# EasyEDA Pro project ProPrj_cheap-board_2026-05-07.epro, schematic Schematic1
Board Name: Board1; Create Date: 2026-01-30; Page Name: P1; Project Name: cheap-board; Schematic Name: Schematic1; Update Date: 2026-02-26; Company: EasyEDA.com; Page Size: A4; Version: V1.0
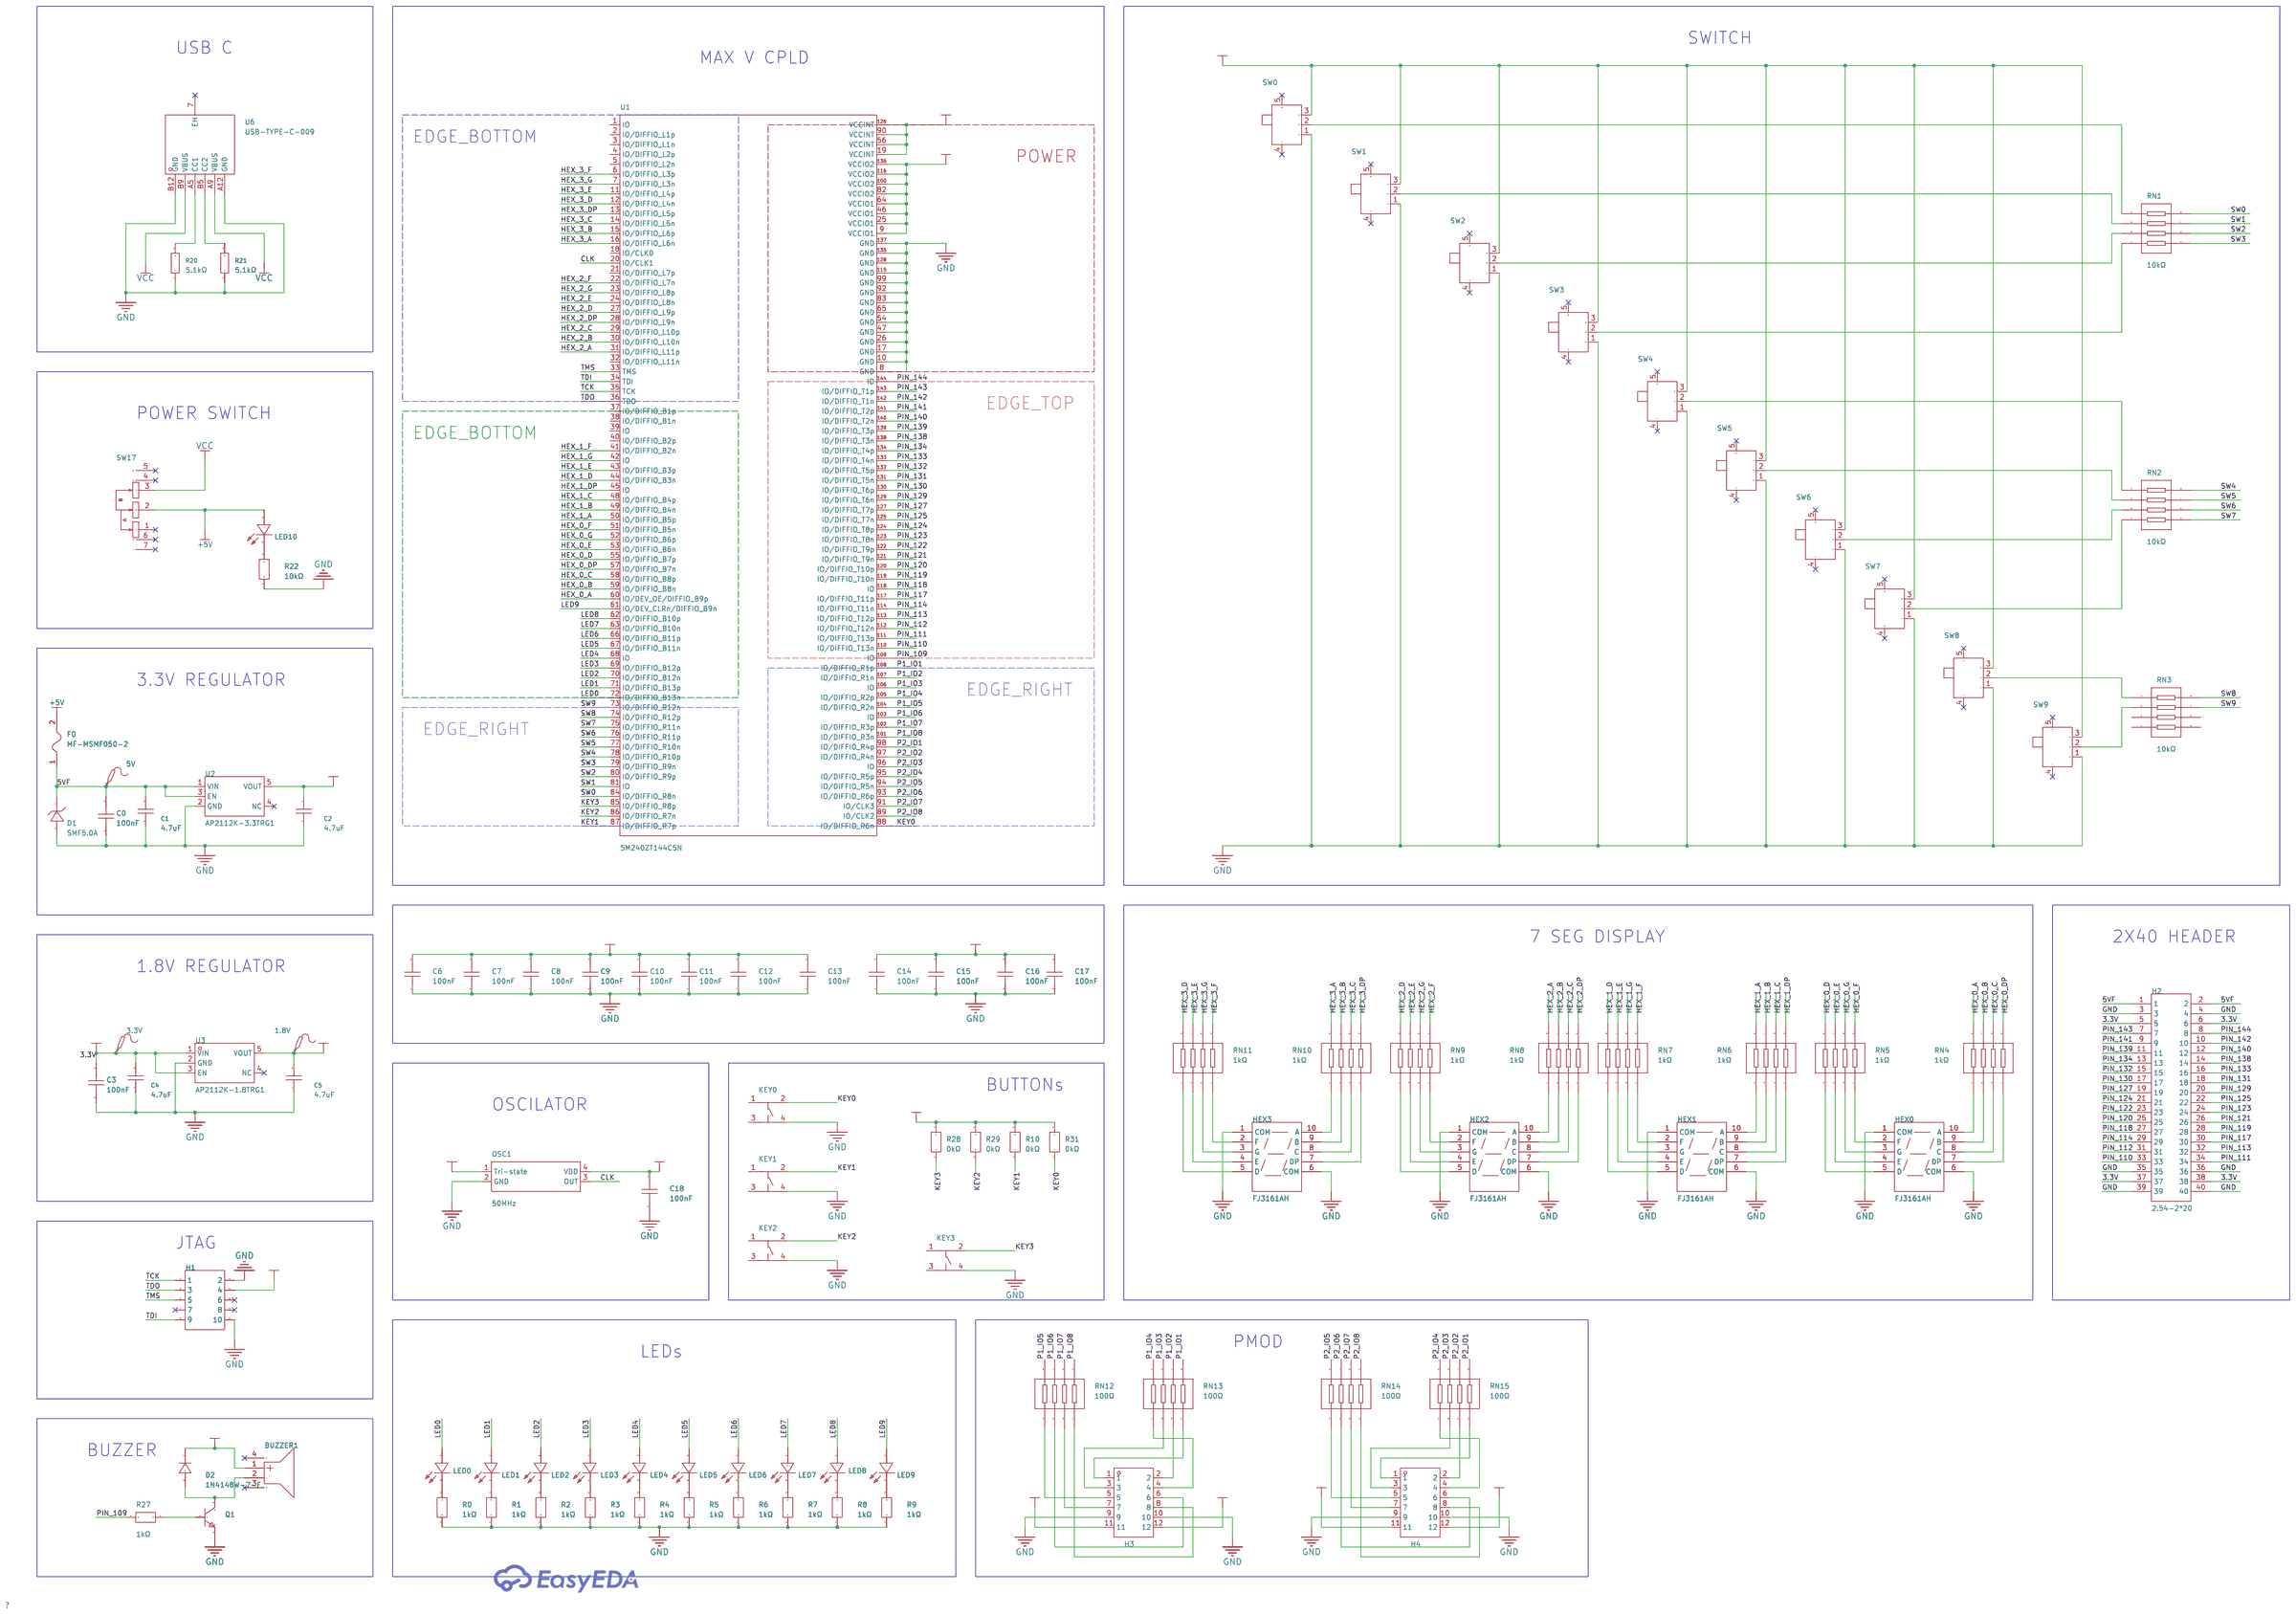
[diagram p0: schematic sheet]

## Parts
1.8V  -  [Test-Point-0.5mm]
3.3V  -  [Test-Point-0.5mm]
5V  -  [Test-Point-0.5mm]
BUZZER1  2.7kHz  [BUZ-SMD_4P-L7.5-W7.5-P7.59-TL]
C0  100nF  [C0603]
C1  4.7uF  [C0603]
C2  4.7uF  [C0603]
C3  100nF  [C0603]
C4  4.7uF  [C0603]
C5  4.7uF  [C0603]
C6  100nF  [C0603]
C7  100nF  [C0603]
C8  100nF  [C0603]
C9  100nF  [C0603]
C10  100nF  [C0603]
C11  100nF  [C0603]
C12  100nF  [C0603]
C13  100nF  [C0603]
C14  100nF  [C0603]
C15  100nF  [C0603]
C16  100nF  [C0603]
C17  100nF  [C0603]
C18  100nF  [C0603]
D1  SMF5.0A  [SOD-123FL_L2.7-W1.8-LS3.8-RD]
D2  1N4148W-7-F  [SOD-123_L2.7-W1.6-LS3.7-RD-1]
F0  MF-MSMF050-2  [F1812]
H1  2.54-2*5P简牛  [IDC-TH_10P-P2.54_C5665]
H2  2.54-2*20  [HDR-TH_40P-P2.54-V-F-R2-C20-S2.54]
H3  HX PM2.54-2x6P WC  [HDR-TH_12P-P2.54-H-F-R2-C6-S2.54-W12.7-N]
H4  HX PM2.54-2x6P WC  [HDR-TH_12P-P2.54-H-F-R2-C6-S2.54-W12.7-N]
HEX0  FJ3161AH  [LED-SEG-TH_10P-L14.0-W7.5-P2.54-S5.08-TL]
HEX1  FJ3161AH  [LED-SEG-TH_10P-L14.0-W7.5-P2.54-S5.08-TL]
HEX2  FJ3161AH  [LED-SEG-TH_10P-L14.0-W7.5-P2.54-S5.08-TL]
HEX3  FJ3161AH  [LED-SEG-TH_10P-L14.0-W7.5-P2.54-S5.08-TL]
KEY0  KH-6X6X6H-STM  [SW-SMD_4P-L6.0-W6.0-P4.50-LS9.0_KH-6X6X6H-STM]
KEY1  KH-6X6X6H-STM  [SW-SMD_4P-L6.0-W6.0-P4.50-LS9.0_KH-6X6X6H-STM]
KEY2  KH-6X6X6H-STM  [SW-SMD_4P-L6.0-W6.0-P4.50-LS9.0_KH-6X6X6H-STM]
KEY3  KH-6X6X6H-STM  [SW-SMD_4P-L6.0-W6.0-P4.50-LS9.0_KH-6X6X6H-STM]
LED0  YLED0603R  [LED0603-FD]
LED1  YLED0603R  [LED0603-FD]
LED2  YLED0603R  [LED0603-FD]
LED3  YLED0603R  [LED0603-FD]
LED4  YLED0603R  [LED0603-FD]
LED5  YLED0603R  [LED0603-FD]
LED6  YLED0603R  [LED0603-FD]
LED7  YLED0603R  [LED0603-FD]
LED8  YLED0603R  [LED0603-FD]
LED9  YLED0603R  [LED0603-FD]
LED10  YLED0603R  [LED0603-FD]
OSC1  50MHz  [OSC-SMD_4P-L3.2-W2.5-BL]
Q1  MMBT3904LT1G  [SOT-23-3_L2.9-W1.6-P1.90-LS2.8-BR]
R0  1kΩ  [R0603]
R1  1kΩ  [R0603]
R2  1kΩ  [R0603]
R3  1kΩ  [R0603]
R4  1kΩ  [R0603]
R5  1kΩ  [R0603]
R6  1kΩ  [R0603]
R7  1kΩ  [R0603]
R8  1kΩ  [R0603]
R9  1kΩ  [R0603]
R10  0kΩ  [R0603]
R20  5.1kΩ  [R0603]
R21  5.1kΩ  [R0603]
R22  10kΩ  [R0603]
R27  1kΩ  [R0603]
R28  0kΩ  [R0603]
R29  0kΩ  [R0603]
R31  0kΩ  [R0603]
RN1  10kΩ  [RES-ARRAY-SMD_0603-8P-L3.2-W1.6-BL]
RN2  10kΩ  [RES-ARRAY-SMD_0603-8P-L3.2-W1.6-BL]
RN3  10kΩ  [RES-ARRAY-SMD_0603-8P-L3.2-W1.6-BL]
RN4  1kΩ  [RES-ARRAY-SMD_0603-8P-L3.2-W1.6-BL]
RN5  1kΩ  [RES-ARRAY-SMD_0603-8P-L3.2-W1.6-BL]
RN6  1kΩ  [RES-ARRAY-SMD_0603-8P-L3.2-W1.6-BL]
RN7  1kΩ  [RES-ARRAY-SMD_0603-8P-L3.2-W1.6-BL]
RN8  1kΩ  [RES-ARRAY-SMD_0603-8P-L3.2-W1.6-BL]
RN9  1kΩ  [RES-ARRAY-SMD_0603-8P-L3.2-W1.6-BL]
RN10  1kΩ  [RES-ARRAY-SMD_0603-8P-L3.2-W1.6-BL]
RN11  1kΩ  [RES-ARRAY-SMD_0603-8P-L3.2-W1.6-BL]
RN12  100Ω  [RES-ARRAY-SMD_0603-8P-L3.2-W1.6-BL]
RN13  100Ω  [RES-ARRAY-SMD_0603-8P-L3.2-W1.6-BL]
RN14  100Ω  [RES-ARRAY-SMD_0603-8P-L3.2-W1.6-BL]
RN15  100Ω  [RES-ARRAY-SMD_0603-8P-L3.2-W1.6-BL]
SW0  SS12F44G4  [SW-TH_SHOU-HAN_SS12F44G4]
SW1  SS12F44G4  [SW-TH_SHOU-HAN_SS12F44G4]
SW2  SS12F44G4  [SW-TH_SHOU-HAN_SS12F44G4]
SW3  SS12F44G4  [SW-TH_SHOU-HAN_SS12F44G4]
SW4  SS12F44G4  [SW-TH_SHOU-HAN_SS12F44G4]
SW5  SS12F44G4  [SW-TH_SHOU-HAN_SS12F44G4]
SW6  SS12F44G4  [SW-TH_SHOU-HAN_SS12F44G4]
SW7  SS12F44G4  [SW-TH_SHOU-HAN_SS12F44G4]
SW8  SS12F44G4  [SW-TH_SHOU-HAN_SS12F44G4]
SW9  SS12F44G4  [SW-TH_SHOU-HAN_SS12F44G4]
SW17  MK-12C02-G020  [SW-SMD_MK-12C02-G020]
U1  5M240ZT144C5N  [TQFP-144_L20.0-W20.0-P0.50-LS22.0-BL]
U2  AP2112K-3.3TRG1  [SOT-23-5_L2.9-W1.6-P0.95-LS2.8-BR]
U3  AP2112K-1.8TRG1  [SOT-25_L3.0-W1.6-P0.95-LS2.8-BL]
U6  USB-TYPE-C-009  [TYPE-C-SMD_TYPE-C-6P]

## Library data of the parts
1.8V 3.3V 5V = Test-Point: Test Point 测试点
BUZZER1 = MLT-7525: Driver Circuitry:Passive (Externally Driven) Technology:Electromagnetic Voltage Rating:3.6V Voltage - Supply:2.5V~4.5V Voltage - Supply:2.5V~4.5V Frequency:2.7kHz Current Consumption:95mA Sound Pressure Level(SPL):80dB Length:7.5mm Width:7.5mm Height:2.8m; LCSC Part Name: 无源(外部驱动) 电磁式 2.7kHz; Supplier Part: C95299; Manufacturer: 华能; Supplier Footprint: SMD,7.5x7.5mm; JLCPCB Part Class: Extended Part; Datasheet: https://item.szlcsc.com/datasheet/MLT-7525/96501.html; Supplier: LCSC; Driver Circuitry: Passive (Externally Driven); Technology: Electromagnetic; Voltage Rating: 3.6V; Voltage - Supply: 2.5V~4.5V; Current Consumption: 95mA; Sound Pressure Level(SPL): 80dB; Length: 7.5mm; Width: 7.5mm; Height: 2.8mm; Operating Temperature: -20℃~+70℃
C0 C3 C6-C18 = CC0603KRX7R9BB104: Capacitance:100nF Tolerance:±10% Tolerance:±10% Voltage Rating:50V Temperature Coefficient:X7R; LCSC Part Name: 100nF ±10% 50V; Supplier Part: C14663; Manufacturer: YAGEO(国巨); Supplier Footprint: 0603; JLCPCB Part Class: Basic Part; Datasheet: https://atta.szlcsc.com/upload/public/pdf/source/20180910/C282072_33301C7F631E79921B82A8DAC6BCC5B3.pdf; Supplier: LCSC; Tolerance: ±10%; Voltage Rating: 50V; Temperature Coefficient: X7R
C1 C2 C4 C5 = CGA0603X7R475K160JT: Capacitance:4.7uF Tolerance:±10% Tolerance:±10% Voltage Rating:16V Temperature Coefficient:X7R; LCSC Part Name: 4.7uF ±10% 16V; Supplier Part: C22399629; Manufacturer: HRE(芯声); Supplier Footprint: 0603; JLCPCB Part Class: Extended Part; Datasheet: https://item.szlcsc.com/datasheet/CGA0603X7R475K160JT/24016453.html; Supplier: LCSC; Tolerance: ±10%; Voltage Rating: 16V; Temperature Coefficient: X7R
D1 = SMF5.0A_C193402: Polarity:Unidirectional Reverse Stand-Off Voltage (Vrwm):5V Clamping Voltage:9.2V Peak Pulse Current (Ipp):21.7A@10/1000us Peak Pulse Power Dissipation (Ppp):200W@10/1000us Voltage - Breakdown:7V Reverse Leakage Current (Ir):400uA Number of Channels:- Ope; LCSC Part Name: 单向TVS 5V截止 峰值脉冲电流：21.7A@10/1000us; Supplier Part: C193402; Manufacturer: MDD(辰达半导体); Supplier Footprint: SOD-123FL; JLCPCB Part Class: Extended Part; Datasheet: https://item.szlcsc.com/datasheet/SMF5.0A/231120.html; Supplier: LCSC; Polarity: Unidirectional; Reverse Stand-Off Voltage (Vrwm): 5V; Clamping Voltage: 9.2V; Peak Pulse Current (Ipp): 21.7A@10/1000us; Peak Pulse Power Dissipation (Ppp): 200W@10/1000us; Voltage - Breakdown: 7V; Reverse Leakage Current (Ir): 400uA; Operating Temperature: -55℃~+150℃; Type: TVS
D2 = 1N4148W-7-F: Diode Configuration:Independent Voltage - Forward(Vf@If):1.25V@150mA Voltage - DC Reverse(Vr):100V Current - Rectified:300mA Pd - Power Dissipation:400mW Reverse Leakage Current (Ir):1uA@75V Reverse Recovery Time (trr):4ns Operating Junction Temperature R; LCSC Part Name: 100V 300mA; Supplier Part: C83528; Manufacturer: DIODES(美台); Supplier Footprint: SOD-123; JLCPCB Part Class: Extended Part; Datasheet: https://item.szlcsc.com/datasheet/1N4148W-7-F/84693.html; Supplier: LCSC; Diode Configuration: Independent; Voltage - Forward(Vf@If): 1.25V@150mA; Voltage - DC Reverse(Vr): 100V; Current - Rectified: 300mA; Pd - Power Dissipation: 400mW; Reverse Leakage Current (Ir): 1uA@75V; Reverse Recovery Time (trr): 4ns; Operating Junction Temperature Range: -65℃~+150℃@(Tj); Non-Repetitive Peak Forward Surge Current: 2A
F0 = MF-MSMF050-2: Voltage - Max:15V Current - Max:100A Hold Current:500mA Trip Current:1A Resistance - Initial (Ri) (Min):150mΩ Resistance - Post Trip (R1) (Max):1Ω Time to Trip(Max):- Operating Temperature:-40℃~+85℃ Operating Temperature:-40℃~+85℃ Length:5.4mm Width:3.2mm; LCSC Part Name: 15V 500mA 1812自恢复; Supplier Part: C17313; Manufacturer: BOURNS; Supplier Footprint: 1812; JLCPCB Part Class: Extended Part; Datasheet: https://item.szlcsc.com/datasheet/MF-MSMF050-2/17998.html; Supplier: LCSC; Voltage - Max: 15V; Current - Max: 100A; Hold Current: 500mA; Trip Current: 1A; Resistance - Initial (Ri) (Min): 150mΩ; Resistance - Post Trip (R1) (Max): 1Ω; Operating Temperature: -40℃~+85℃; Length: 5.4mm; Width: 3.2mm
H1 = 2.54-2*5P简牛: Connector Type:IDC Header Pitch:2.54mm Number of Positions or Pins:2x5P Current Rating:1A Holder Type:Through Hole Row Spacing:2.54mm Number of Rows:2 Number of PINs Per Row:5 Contact Material:Brass Contact Plating:Gold Operating Temperature:-55℃~+105℃ Op; LCSC Part Name: 2.54mm 2x5P 排数:2 每排P数:5; Supplier Part: C5665; Manufacturer: BOOMELE(博穆精密); Supplier Footprint: 插件,P=2.54mm; JLCPCB Part Class: Extended Part; Datasheet: https://item.szlcsc.com/datasheet/2.54-2*5P%25E7%25AE%2580%25E7%2589%259B/6118.html; Supplier: LCSC; Connector Type: IDC Header; Pitch: 2.54mm; Number of Positions or Pins: 2x5P; Current Rating: 1A; Holder Type: Through Hole; Row Spacing: 2.54mm; Number of Rows: 2; Number of PINs Per Row: 5; Contact Material: Brass; Contact Plating: Gold; Operating Temperature: -55℃~+105℃; Color: Black
H2 = 2.54-2*20: Holes Structure:2x20P Pitch:2.54mm Row Spacing:2.54mm Circular Hole / Square Hole:Square Hole Mounting Type:Through Hole Number of Rows:2 Number of Positions:40P Current Rating:2.5A Voltage Rating (Max):- Holes Direction:Top Insulation Height:8.5mm Operat; LCSC Part Name: 间距:2.54mm 2x20P 直插; Supplier Part: C2977589; Manufacturer: ZHOURI(洲日); Supplier Footprint: 插件,P=2.54mm; JLCPCB Part Class: Extended Part; Datasheet: https://item.szlcsc.com/datasheet/2.54-2*20/3388941.html; Supplier: LCSC; Holes Structure: 2x20P; Pitch: 2.54mm; Row Spacing: 2.54mm; Circular Hole / Square Hole: Square Hole; Mounting Type: Through Hole; Number of Rows: 2; Number of Positions: 40P; Current Rating: 2.5A; Holes Direction: Top; Insulation Height: 8.5mm; Operating Temperature: -40℃~+105℃
H3 H4 = HX PM2.54-2x6P WC: Holes Structure:2x6P Pitch:2.54mm Row Spacing:2.54mm Circular Hole / Square Hole:Square Hole Mounting Type:Right Angle Number of Rows:2 Number of Positions:12P Current Rating:3A Voltage Rating (Max):1kV Holes Direction:Side Insulation Height:8.5mm Contact; LCSC Part Name: 2x6P 间距:2.54mm 弯插; Supplier Part: C41417336; Manufacturer: hanxia(韩下); Supplier Footprint: 弯插,P=2.54mm; Datasheet: https://item.szlcsc.com/datasheet/HX%2520PM2.54-2x6P%2520WC/43243340.html; Supplier: LCSC; Holes Structure: 2x6P; Pitch: 2.54mm; Row Spacing: 2.54mm; Circular Hole / Square Hole: Square Hole; Mounting Type: Right Angle; Number of Rows: 2; Number of Positions: 12P; Current Rating: 3A; Voltage Rating (Max): 1kV; Holes Direction: Side; Insulation Height: 8.5mm; Contact Material: Brass; Contact Plating: Gold; Operating Temperature: -40℃~+105℃; PIN Length: 3.2mm
HEX0-HEX3 = FJ3161AH: Digit/Alpha Size(inch):0.36 Illumination Color:Red LED Polarity:Common Cathode; LCSC Part Name: 0.36英寸红色数码管 共阴极; Supplier Part: C10684; Manufacturer: 志浩; Supplier Footprint: 插件; JLCPCB Part Class: Extended Part; Datasheet: https://item.szlcsc.com/datasheet/FJ3161AH/11228.html; Supplier: LCSC; Digit/Alpha Size(inch): 0.36; Illumination Color: Red; LED Polarity: Common Cathode
KEY0-KEY3 = KH-6X6X6H-STM: Circuit:SPST Actuator Style:Round Button Mounting Type:Surface Mount,Vertical Length:6mm Width:6mm Switch Height:6mm with Bracket:Without Bracket Contact Current:50mA Voltage Rating:12V Actuator/Cap Color:Black Termination Style:Gull Wing Life:80,000 Cycl; LCSC Part Name: 6*6*6mm 立贴 轻触开关; Supplier Part: C2837532; Manufacturer: kinghelm(金航标); Supplier Footprint: SMD-4P,6x6mm; JLCPCB Part Class: Extended Part; Datasheet: https://item.szlcsc.com/datasheet/KH-6X6X6H-STM/3009602.html; Supplier: LCSC; Circuit: SPST; Actuator Style: Round Button; Mounting Type: Surface Mount,Vertical; Length: 6mm; Width: 6mm; Switch Height: 6mm; with Bracket: Without Bracket; Contact Current: 50mA; Voltage Rating: 12V; Actuator/Cap Color: Black; Termination Style: Gull Wing; Life: 80,000 Cycles
LED0-LED10 = YLED0603R: Lamp Holder Type:-；- Illumination Color:Red Voltage - Forward(Vf):1.8V~2.4V Voltage - Forward(Vf):1.8V~2.4V Power(Watts):- Forward Current:25mA Wavelength - Dominant:620nm~625nm Wavelength - Dominant:620nm~625nm Peak Wavelength:- Diode Configuration:Discr; LCSC Part Name: 红色 独立二极管; Supplier Part: C19171390; Manufacturer: YONGYUTAI(永裕泰); Supplier Footprint: 0603; JLCPCB Part Class: Extended Part; Datasheet: https://item.szlcsc.com/datasheet/YLED0603R/20382441.html; Supplier: LCSC; Lamp Holder Type: -；-; Illumination Color: Red; Voltage - Forward(Vf): 1.8V~2.4V; Forward Current: 25mA; Wavelength - Dominant: 620nm~625nm; Diode Configuration: Discrete Diode; Luminous Intensity: 120mcd; Viewing Angle: 120°; Operating Temperature: -40℃~+85℃
OSC1 = OT2EL4C4JI-111OLP-50M: Frequency:50MHz Normal temperature Frequency Tolerance:±10ppm Normal temperature Frequency Tolerance:±10ppm Output Type:CMOS Voltage - Supply:1.8V~3.3V Voltage - Supply:1.8V~3.3V Frequency Stability:±20ppm Frequency Stability:±20ppm Operating Temperature:; LCSC Part Name: YSO110TR 50MHZ 1.8V-3.3V ±10PPM -40~85℃ (±20PPM) CMOS; Supplier Part: C5203552; Manufacturer: YXC(扬兴晶振); Supplier Footprint: SMD3225-4P; JLCPCB Part Class: Extended Part; Datasheet: https://item.szlcsc.com/datasheet/OT2EL4C4JI-111OLP-50M/5892914.html; Supplier: LCSC; Normal temperature Frequency Tolerance: ±10ppm; Output Type: CMOS; Voltage - Supply: 1.8V~3.3V; Frequency Stability: ±20ppm; Operating Temperature: -40℃~+85℃
Q1 = MMBT3904LT1G: type:NPN Current - Collector(Ic):200mA Collector - Emitter Voltage VCEO:40V Pd - Power Dissipation:225mW DC Current Gain:40@0.1mA,1.0V DC Current Gain:40@0.1mA,1.0V Transition frequency(fT):300MHz Current - Collector Cutoff:50nA Vce Saturation(VCE(sat)):2; LCSC Part Name: NPN 电流:200mA 电压:40V; Supplier Part: C81464; Manufacturer: onsemi(安森美); Supplier Footprint: SOT-23; JLCPCB Part Class: Extended Part; Datasheet: https://item.szlcsc.com/datasheet/MMBT3904LT1G/82615.html; Supplier: LCSC; type: NPN; Current - Collector(Ic): 200mA; Collector - Emitter Voltage VCEO: 40V; Pd - Power Dissipation: 225mW; DC Current Gain: 40@0.1mA,1.0V; Transition frequency(fT): 300MHz; Current - Collector Cutoff: 50nA; Vce Saturation(VCE(sat)): 200mV; Operating Temperature: -55℃~+150℃
R0-R10 R22 R27-R29 R31 = RC0603FR-071KL: Type:Thick Film Resistor Resistance:1kΩ Tolerance:±1% Tolerance:±1% Power(Watts):100mW Voltage-Supply(Max):75V Temperature Coefficient:±100ppm/℃ Temperature Coefficient:±100ppm/℃ Operating Temperature:-55℃~+155℃ Operating Temperature:-55℃~+155℃; LCSC Part Name: 厚膜电阻 1kΩ ±1% 100mW; Supplier Part: C22548; Manufacturer: YAGEO(国巨); Supplier Footprint: 0603; JLCPCB Part Class: Extended Part; Datasheet: https://item.szlcsc.com/datasheet/RC0603FR-071KL/23274.html; Supplier: LCSC; Type: Thick Film Resistor; Tolerance: ±1%; Power(Watts): 100mW; Voltage-Supply(Max): 75V; Temperature Coefficient: ±100ppm/℃; Operating Temperature: -55℃~+155℃
R20 R21 = RMC06035.1K1%N: Type:Thick Film Resistor Resistance:5.1kΩ Tolerance:±1% Tolerance:±1% Power(Watts):100mW Voltage-Supply(Max):50V Temperature Coefficient:±100ppm/℃ Temperature Coefficient:±100ppm/℃ Operating Temperature:-55℃~+155℃ Operating Temperature:-55℃~+155℃; LCSC Part Name: 厚膜电阻 5.1kΩ ±1% 100mW; Supplier Part: C269716; Manufacturer: Tyohm(幸亚电阻); Supplier Footprint: 0603; JLCPCB Part Class: Extended Part; Datasheet: https://item.szlcsc.com/datasheet/RMC06035.1K1%2525N/259156.html; Supplier: LCSC; Type: Thick Film Resistor; Tolerance: ±1%; Power(Watts): 100mW; Voltage-Supply(Max): 50V; Temperature Coefficient: ±100ppm/℃; Operating Temperature: -55℃~+155℃
RN1-RN3 = 4D03WGJ0103T5E: Number of Resistors: Resistance:10kΩ Tolerance:±5% Tolerance:±5% Power(Watts): Temperature Coefficient:±200ppm/℃ Temperature Coefficient:±200ppm/℃ Number of Pins:; LCSC Part Name: 10kΩ ±5%; Supplier Part: C29718; Manufacturer: UNI-ROYAL(厚声); Supplier Footprint: 0603x4; JLCPCB Part Class: Basic Part; Datasheet: https://atta.szlcsc.com/upload/public/pdf/source/20191224/C474318_2527498AE30E813171187CCD28401A71.pdf; Supplier: LCSC; Tolerance: ±5%; Temperature Coefficient: ±200ppm/℃
RN4-RN11 = 4D03WGJ0102T5E: Number of Resistors: Resistance:1kΩ Tolerance:±5% Tolerance:±5% Power(Watts): Temperature Coefficient:±200ppm/℃ Temperature Coefficient:±200ppm/℃ Number of Pins:; LCSC Part Name: 1kΩ ±5%; Supplier Part: C20197; Manufacturer: UNI-ROYAL(厚声); Supplier Footprint: 0603x4; JLCPCB Part Class: Basic Part; Datasheet: https://atta.szlcsc.com/upload/public/pdf/source/20191224/C474318_2527498AE30E813171187CCD28401A71.pdf; Supplier: LCSC; Tolerance: ±5%; Temperature Coefficient: ±200ppm/℃
RN12-RN15 = YC164-FR-07100RL: Number of Resistors: Resistance:100Ω Tolerance:±1% Tolerance:±1% Power(Watts):62.5mW Temperature Coefficient:±200ppm/℃ Temperature Coefficient:±200ppm/℃ Number of Pins:; LCSC Part Name: 100Ω ±1%; Supplier Part: C136838; Manufacturer: YAGEO(国巨); Supplier Footprint: 0603x4; JLCPCB Part Class: Extended Part; Datasheet: https://item.szlcsc.com/datasheet/YC164-FR-07100RL/148154.html; Supplier: LCSC; Tolerance: ±1%; Power(Watts): 62.5mW; Temperature Coefficient: ±200ppm/℃
SW0-SW9 = SS12F44G4: Circuit:SPDT Actuator Style:- Termination Style:PC Pin Length:12mm Width:4.5mm Switch Height:6mm Mounting Type:Through Hole Actuator Color:- Current Rating:300mA Voltage Rating:50V Life:5,000 cycles Operating Temperature:-10℃~+50℃ Operating Temperature:-1; Supplier Part: C2887261; Manufacturer: SHOU HAN(首韩); Supplier Footprint: 插件,12x4.5mm; JLCPCB Part Class: Extended Part; Datasheet: https://item.szlcsc.com/datasheet/SS12F44G4/3103829.html; Supplier: LCSC; Circuit: SPDT; Termination Style: PC Pin; Length: 12mm; Width: 4.5mm; Switch Height: 6mm; Mounting Type: Through Hole; Current Rating: 300mA; Voltage Rating: 50V; Life: 5,000 cycles; Operating Temperature: -10℃~+50℃
SW17 = MK-12C02-G020: Circuit:SPDT Actuator Style:Rectangular Columnar Termination Style:- Length:6.6mm Width:1.4mm Switch Height:4.7mm Mounting Type:Surface Mount, Right Angle Actuator Color:Black Current Rating:1A Voltage Rating:6V Life:10,000 Cycles Operating Temperature:-2; LCSC Part Name: 微型拨动开关; Supplier Part: C963206; Manufacturer: G-Switch(品赞); Supplier Footprint: SMD,6.6x1.4mm; JLCPCB Part Class: Extended Part; Datasheet: https://item.szlcsc.com/datasheet/MK-12C02-G020/1046841.html; Supplier: LCSC; Circuit: SPDT; Actuator Style: Rectangular Columnar; Length: 6.6mm; Width: 1.4mm; Switch Height: 4.7mm; Mounting Type: Surface Mount, Right Angle; Actuator Color: Black; Current Rating: 1A; Voltage Rating: 6V; Life: 10,000 Cycles; Operating Temperature: -20℃~+70℃
U1 = 5M240ZT144C5N: Type:Other PLDs Logic Array Blocks:240 Operating Temperature:0℃~+85℃ Operating Temperature:0℃~+85℃; Supplier Part: C1521424; Manufacturer: Intel/Altera; Supplier Footprint: TQFP-144(20x20); JLCPCB Part Class: Extended Part; Datasheet: https://item.szlcsc.com/datasheet/5M240ZT144C5N/1612222.html; Supplier: LCSC; Type: Other PLDs; Logic Array Blocks: 240; Operating Temperature: 0℃~+85℃
U2 = AP2112K-3.3TRG1_C23380830: Output Type:Fixed Voltage - Supply:5.5V Output Voltage:3.3V Output Voltage:3.3V Output Current:600mA Power Supply Rejection Ratio (PSRR):75dB@(1kHz) Voltage Dropout:320mV@(600mA) standby current:10uA Features:Over Temperature Protection Operating Temperat; LCSC Part Name: 3.3V 600mA 5.5V; Supplier Part: C23380830; Manufacturer: TECH PUBLIC(台舟); Supplier Footprint: SOT-23-5; JLCPCB Part Class: Extended Part; Datasheet: https://item.szlcsc.com/datasheet/AP2112K-3.3TRG1/25111500.html; Supplier: LCSC; Output Type: Fixed; Voltage - Supply: 5.5V; Output Voltage: 3.3V; Output Current: 600mA; Power Supply Rejection Ratio (PSRR): 75dB@(1kHz); Voltage Dropout: 320mV@(600mA); standby current: 10uA; Features: Over Temperature Protection; Operating Temperature: -40℃~+85℃@(Ta); Output Configuration: Positive; Number of Outputs: 1
U3 = AP2112K-1.8TRG1: Output Type:Fixed Voltage - Supply:6V Output Voltage:1.8V Output Voltage:1.8V Output Current:600mA Power Supply Rejection Ratio (PSRR):65dB@(1kHz) Voltage Dropout:500mV@(600mA) standby current:55uA Noise:50uVrms Features:Over Current Protection；Enable；Ove; LCSC Part Name: 1.8V 600mA 6V; Supplier Part: C176944; Manufacturer: DIODES(美台); Supplier Footprint: SOT-25; JLCPCB Part Class: Extended Part; Datasheet: https://item.szlcsc.com/datasheet/AP2112K-1.8TRG1/188335.html; Supplier: LCSC; Output Type: Fixed; Voltage - Supply: 6V; Output Voltage: 1.8V; Output Current: 600mA; Power Supply Rejection Ratio (PSRR): 65dB@(1kHz); Voltage Dropout: 500mV@(600mA); standby current: 55uA; Noise: 50uVrms; Features: Over Current Protection；Enable；Over Temperature Protection; Operating Temperature: -40℃~+85℃@(Ta); Output Configuration: Positive; Number of Outputs: 1
U6 = USB-TYPE-C-009: Connector Type:Type-C Protocol Standard:- Gender:Female Mounting Type:Surface Mount, Right Angle Number of Contacts:6P Number of Ports:1 Current Rating-Power:5A Voltage Rating:5V Connect-Disconnect Life:10,000 cycles Length:6.8mm Operating Temperature:-25; LCSC Part Name: Type-C 母 卧贴; Supplier Part: C2927029; Manufacturer: DEALON(德艺隆); Supplier Footprint: SMD; JLCPCB Part Class: Extended Part; Datasheet: https://item.szlcsc.com/datasheet/USB-TYPE-C-009/3252498.html; Supplier: LCSC; Connector Type: Type-C; Gender: Female; Mounting Type: Surface Mount, Right Angle; Number of Contacts: 6P; Number of Ports: 1; Current Rating-Power: 5A; Voltage Rating: 5V; Connect-Disconnect Life: 10,000 cycles; Length: 6.8mm; Operating Temperature: -25℃~+85℃

## Nets
1.8V: 1.8V.1 C5.2 C14.2 C15.2 C16.2 C17.2 U1.19(VCCINT) U1.56(VCCINT) U1.90(VCCINT) U1.126(VCCINT) U3.5(VOUT)
3.3V: 3.3V.1 BUZZER1.1(+) C2.2 C3.2 C4.2 C6.2 C7.2 C8.2 C9.2 C10.2 C11.2 C12.2 C13.2 C18.2 D2.1(C) H1.4 H2.5 H2.6 H2.37 H2.38 H3.11 H3.12 H4.11 H4.12 OSC1.1(Tri-state) OSC1.4(VDD) R10.2 R28.2 R29.2 R31.2 SW0.3 SW1.3 SW2.3 SW3.3 SW4.3 SW5.3 SW6.3 SW7.3 SW8.3 SW9.3 U1.9(VCCIO1) U1.25(VCCIO1) U1.46(VCCIO1) U1.64(VCCIO1) U1.82(VCCIO2) U1.100(VCCIO2) U1.116(VCCIO2) U1.136(VCCIO2) U2.5(VOUT) U3.1(VIN) U3.3(EN)
5VF: 5V.1 C0.2 C1.2 D1.1(C) F0.1 H2.1 H2.2 U2.1(VIN) U2.3(EN)
+5V: F0.2 LED10.1(+) SW17.2
GND: C0.1 C1.1 C2.1 C3.1 C4.1 C5.1 C6.1 C7.1 C8.1 C9.1 C10.1 C11.1 C12.1 C13.1 C14.1 C15.1 C16.1 C17.1 C18.1 D1.2(A) H1.2 H1.10 H2.3 H2.4 H2.35 H2.36 H2.39 H2.40 H3.9 H3.10 H4.9 H4.10 HEX0.1(COM) HEX0.6(COM) HEX1.1(COM) HEX1.6(COM) HEX2.1(COM) HEX2.6(COM) HEX3.1(COM) HEX3.6(COM) KEY0.4(D) KEY1.4(D) KEY2.4(D) KEY3.4(D) OSC1.2(GND) Q1.2 R0.1 R1.1 R2.1 R3.1 R4.1 R5.1 R6.1 R7.1 R8.1 R9.1 R20.1 R21.1 R22.1 SW0.1 SW1.1 SW2.1 SW3.1 SW4.1 SW5.1 SW6.1 SW7.1 SW8.1 SW9.1 U1.8(GND) U1.10(GND) U1.17(GND) U1.26(GND) U1.47(GND) U1.54(GND) U1.65(GND) U1.83(GND) U1.92(GND) U1.99(GND) U1.115(GND) U1.128(GND) U1.135(GND) U1.137(GND) U2.2(GND) U3.2(GND) U6.A12(GND) U6.B12(GND)
VCC: SW17.3 U6.A9(VBUS) U6.B9(VBUS)
CLK: OSC1.3(OUT) U1.20(IO/CLK1)
HEX_0_A: RN4.8 U1.60(IO/DEV_OE/DIFFIO_B9p)
HEX_0_B: RN4.7 U1.59(IO/DIFFIO_B8n)
HEX_0_C: RN4.6 U1.58(IO/DIFFIO_B8p)
HEX_0_D: RN5.8 U1.55(IO/DIFFIO_B7p)
HEX_0_DP: RN4.5 U1.57(IO/DIFFIO_B7n)
HEX_0_E: RN5.7 U1.53(IO/DIFFIO_B6n)
HEX_0_F: RN5.5 U1.51(IO/DIFFIO_B5n)
HEX_0_G: RN5.6 U1.52(IO/DIFFIO_B6p)
HEX_1_A: RN6.8 U1.50(IO/DIFFIO_B5p)
HEX_1_B: RN6.7 U1.49(IO/DIFFIO_B4n)
HEX_1_C: RN6.6 U1.48(IO/DIFFIO_B4p)
HEX_1_D: RN7.8 U1.44(IO/DIFFIO_B3n)
HEX_1_DP: RN6.5 U1.45(IO)
HEX_1_E: RN7.7 U1.43(IO/DIFFIO_B3p)
HEX_1_F: RN7.5 U1.41(IO/DIFFIO_B2n)
HEX_1_G: RN7.6 U1.42(IO)
HEX_2_A: RN8.8 U1.31(IO/DIFFIO_L11p)
HEX_2_B: RN8.7 U1.30(IO/DIFFIO_L10n)
HEX_2_C: RN8.6 U1.29(IO/DIFFIO_L10p)
HEX_2_D: RN9.8 U1.27(IO/DIFFIO_L9p)
HEX_2_DP: RN8.5 U1.28(IO/DIFFIO_L9n)
HEX_2_E: RN9.7 U1.24(IO/DIFFIO_L8n)
HEX_2_F: RN9.5 U1.22(IO/DIFFIO_L7n)
HEX_2_G: RN9.6 U1.23(IO/DIFFIO_L8p)
HEX_3_A: RN10.8 U1.16(IO/DIFFIO_L6n)
HEX_3_B: RN10.7 U1.15(IO/DIFFIO_L6p)
HEX_3_C: RN10.6 U1.14(IO/DIFFIO_L5n)
HEX_3_D: RN11.8 U1.12(IO/DIFFIO_L4n)
HEX_3_DP: RN10.5 U1.13(IO/DIFFIO_L5p)
HEX_3_E: RN11.7 U1.11(IO/DIFFIO_L4p)
HEX_3_F: RN11.5 U1.6(IO/DIFFIO_L3p)
HEX_3_G: RN11.6 U1.7(IO/DIFFIO_L3n)
KEY0: KEY0.2(B) R31.1 U1.88(IO/DIFFIO_R6n)
KEY1: KEY1.2(B) R10.1 U1.87(IO/DIFFIO_R7p)
KEY2: KEY2.2(B) R29.1 U1.86(IO/DIFFIO_R7n)
KEY3: KEY3.2(B) R28.1 U1.85(IO/DIFFIO_R8p)
LED0: LED0.1(+) U1.72(IO/DIFFIO_B13n)
LED1: LED1.1(+) U1.71(IO/DIFFIO_B13p)
LED2: LED2.1(+) U1.70(IO/DIFFIO_B12n)
LED3: LED3.1(+) U1.69(IO/DIFFIO_B12p)
LED4: LED4.1(+) U1.68(IO)
LED5: LED5.1(+) U1.67(IO/DIFFIO_B11n)
LED6: LED6.1(+) U1.66(IO/DIFFIO_B11p)
LED7: LED7.1(+) U1.63(IO/DIFFIO_B10n)
LED8: LED8.1(+) U1.62(IO/DIFFIO_B10p)
LED9: LED9.1(+) U1.61(IO/DEV_CLRn/DIFFIO_B9n)
P1_IO1: RN13.8 U1.108(IO/DIFFIO_R1p)
P1_IO2: RN13.7 U1.107(IO/DIFFIO_R1n)
P1_IO3: RN13.6 U1.106(IO)
P1_IO4: RN13.5 U1.105(IO/DIFFIO_R2p)
P1_IO5: RN12.8 U1.104(IO/DIFFIO_R2n)
P1_IO6: RN12.7 U1.103(IO)
P1_IO7: RN12.6 U1.102(IO/DIFFIO_R3p)
P1_IO8: RN12.5 U1.101(IO/DIFFIO_R3n)
P2_IO1: RN15.8 U1.98(IO/DIFFIO_R4p)
P2_IO2: RN15.7 U1.97(IO/DIFFIO_R4n)
P2_IO3: RN15.6 U1.96(IO)
P2_IO4: RN15.5 U1.95(IO/DIFFIO_R5p)
P2_IO5: RN14.8 U1.94(IO/DIFFIO_R5n)
P2_IO6: RN14.7 U1.93(IO/DIFFIO_R6p)
P2_IO7: RN14.6 U1.91(IO/CLK3)
P2_IO8: RN14.5 U1.89(IO/CLK2)
PIN_109: R27.2 U1.109(IO)
PIN_110: H2.33 U1.110(IO/DIFFIO_T13n)
PIN_111: H2.34 U1.111(IO/DIFFIO_T13p)
PIN_112: H2.31 U1.112(IO/DIFFIO_T12n)
PIN_113: H2.32 U1.113(IO/DIFFIO_T12p)
PIN_114: H2.29 U1.114(IO/DIFFIO_T11n)
PIN_117: H2.30 U1.117(IO/DIFFIO_T11p)
PIN_118: H2.27 U1.118(IO)
PIN_119: H2.28 U1.119(IO/DIFFIO_T10n)
PIN_120: H2.25 U1.120(IO/DIFFIO_T10p)
PIN_121: H2.26 U1.121(IO/DIFFIO_T9n)
PIN_122: H2.23 U1.122(IO/DIFFIO_T9p)
PIN_123: H2.24 U1.123(IO/DIFFIO_T8n)
PIN_124: H2.21 U1.124(IO/DIFFIO_T8p)
PIN_125: H2.22 U1.125(IO/DIFFIO_T7n)
PIN_127: H2.19 U1.127(IO/DIFFIO_T7p)
PIN_129: H2.20 U1.129(IO/DIFFIO_T6n)
PIN_130: H2.17 U1.130(IO/DIFFIO_T6p)
PIN_131: H2.18 U1.131(IO/DIFFIO_T5n)
PIN_132: H2.15 U1.132(IO/DIFFIO_T5p)
PIN_133: H2.16 U1.133(IO/DIFFIO_T4n)
PIN_134: H2.13 U1.134(IO/DIFFIO_T4p)
PIN_138: H2.14 U1.138(IO/DIFFIO_T3n)
PIN_139: H2.11 U1.139(IO/DIFFIO_T3p)
PIN_140: H2.12 U1.140(IO/DIFFIO_T2n)
PIN_141: H2.9 U1.141(IO/DIFFIO_T2p)
PIN_142: H2.10 U1.142(IO/DIFFIO_T1n)
PIN_143: H2.7 U1.143(IO/DIFFIO_T1p)
PIN_144: H2.8 U1.144(IO)
SW0: RN1.8 U1.84(IO/DIFFIO_R8n)
SW1: RN1.7 U1.81(IO)
SW2: RN1.6 U1.80(IO/DIFFIO_R9p)
SW3: RN1.5 U1.79(IO/DIFFIO_R9n)
SW4: RN2.8 U1.78(IO/DIFFIO_R10p)
SW5: RN2.7 U1.77(IO/DIFFIO_R10n)
SW6: RN2.6 U1.76(IO/DIFFIO_R11p)
SW7: RN2.5 U1.75(IO/DIFFIO_R11n)
SW8: RN3.8 U1.74(IO/DIFFIO_R12p)
SW9: RN3.7 U1.73(IO/DIFFIO_R12n)
TCK: H1.1 U1.35(TCK)
TDI: H1.9 U1.34(TDI)
TDO: H1.3 U1.36(TDO)
TMS: H1.5 U1.33(TMS)
$1N1578: RN2.2 SW5.2
$1N1579: RN2.3 SW6.2
$1N1580: RN1.2 SW1.2
$1N1581: RN1.3 SW2.2
$1N1582: RN1.4 SW3.2
$1N1583: RN2.1 SW4.2
$1N1602: RN1.1 SW0.2
$1N5270: LED3.2(-) R3.2
$1N5271: LED2.2(-) R2.2
$1N5272: LED5.2(-) R5.2
$1N5273: LED4.2(-) R4.2
$1N5274: LED7.2(-) R7.2
$1N5275: LED1.2(-) R1.2
$1N5276: LED6.2(-) R6.2
$1N5281: LED0.2(-) R0.2
$1N5960: LED9.2(-) R9.2
$1N5966: LED8.2(-) R8.2
$1N21558: RN2.4 SW7.2
$1N21605: RN3.1 SW8.2
$1N21745: RN3.2 SW9.2
$1N29238: R20.2 U6.A5(CC1)
$1N29243: R21.2 U6.B5(CC2)
$1N32570: LED10.2(-) R22.2
$1N67022: Q1.1 R27.1
$1N67183: BUZZER1.2(-) D2.2(A) Q1.3
$1N75208: HEX0.10(A) RN4.1
$1N75216: HEX0.9(B) RN4.2
$1N75222: HEX0.8(C) RN4.3
$1N75228: HEX0.7(DP) RN4.4
$1N75251: HEX0.2(F) RN5.4
$1N75256: HEX0.3(G) RN5.3
$1N75262: HEX0.4(E) RN5.2
$1N75268: HEX0.5(D) RN5.1
$1N75461: HEX1.4(E) RN7.2
$1N75464: HEX1.3(G) RN7.3
$1N75467: HEX1.2(F) RN7.4
$1N75470: HEX1.5(D) RN7.1
$1N75474: HEX1.10(A) RN6.1
$1N75477: HEX1.9(B) RN6.2
$1N75480: HEX1.8(C) RN6.3
$1N75483: HEX1.7(DP) RN6.4
$1N75690: HEX2.4(E) RN9.2
$1N75693: HEX2.3(G) RN9.3
$1N75696: HEX2.2(F) RN9.4
$1N75699: HEX2.5(D) RN9.1
$1N75703: HEX2.10(A) RN8.1
$1N75706: HEX2.9(B) RN8.2
$1N75709: HEX2.8(C) RN8.3
$1N75712: HEX2.7(DP) RN8.4
$1N75919: HEX3.4(E) RN11.2
$1N75922: HEX3.3(G) RN11.3
$1N75925: HEX3.2(F) RN11.4
$1N75928: HEX3.5(D) RN11.1
$1N75932: HEX3.10(A) RN10.1
$1N75935: HEX3.9(B) RN10.2
$1N75938: HEX3.8(C) RN10.3
$1N75941: HEX3.7(DP) RN10.4
$1N98164: H4.6 RN14.2
$1N98167: H4.1 RN15.1
$1N98168: H4.4 RN15.4
$1N98171: H3.6 RN12.2
$1N98172: H3.5 RN12.1
$1N98173: H3.7 RN12.3
$1N98174: H3.3 RN13.3
$1N98175: H3.1 RN13.1
$1N98177: H3.4 RN13.4
$1N98179: H3.8 RN12.4
$1N98180: H3.2 RN13.2
$1N98181: H4.2 RN15.2
$1N98182: H4.8 RN14.4
$1N98183: H4.7 RN14.3
$1N98184: H4.3 RN15.3
$1N98185: H4.5 RN14.1

Not connected (* = marked no-connect by the designer): BUZZER1 3* 4*; H1 6* 7* 8*; KEY0 1(A) 3(C); KEY1 1(A) 3(C); KEY2 1(A) 3(C); KEY3 1(A) 3(C); RN3 3 4 5 6; SW0 4* 5*; SW1 4* 5*; SW2 4* 5*; SW3 4* 5*; SW4 4* 5*; SW5 4* 5*; SW6 4* 5*; SW7 4* 5*; SW8 4* 5*; SW9 4* 5*; SW17 1* 4* 5* 6* 7*; U1 1(IO) 2(IO/DIFFIO_L1p) 3(IO/DIFFIO_L1n) 4(IO/DIFFIO_L2p) 5(IO/DIFFIO_L2n) 18(IO/CLK0) 21(IO/DIFFIO_L7p) 32(IO/DIFFIO_L11n) 37(IO/DIFFIO_B1p) 38(IO/DIFFIO_B1n) 39(IO) 40(IO/DIFFIO_B2p); U2 4(NC)*; U3 4(NC)*; U6 7(EH)*

## Notes on the sheet
- SWITCH
- USB C
- MAX V CPLD
- EDGE_BOTTOM
- POWER
- EDGE_TOP
- POWER SWITCH
- EDGE_BOTTOM
- 3.3V REGULATOR
- EDGE_RIGHT
- EDGE_RIGHT
- 7 SEG DISPLAY
- 2X40 HEADER
- 1.8V REGULATOR
- BUTTONs
- OSCILATOR
- JTAG
- PMOD
- LEDs
- BUZZER
